# Altium schematic sheet semiCon.SchDoc
size A4; SheetNumber: 3; SheetTotal: 6
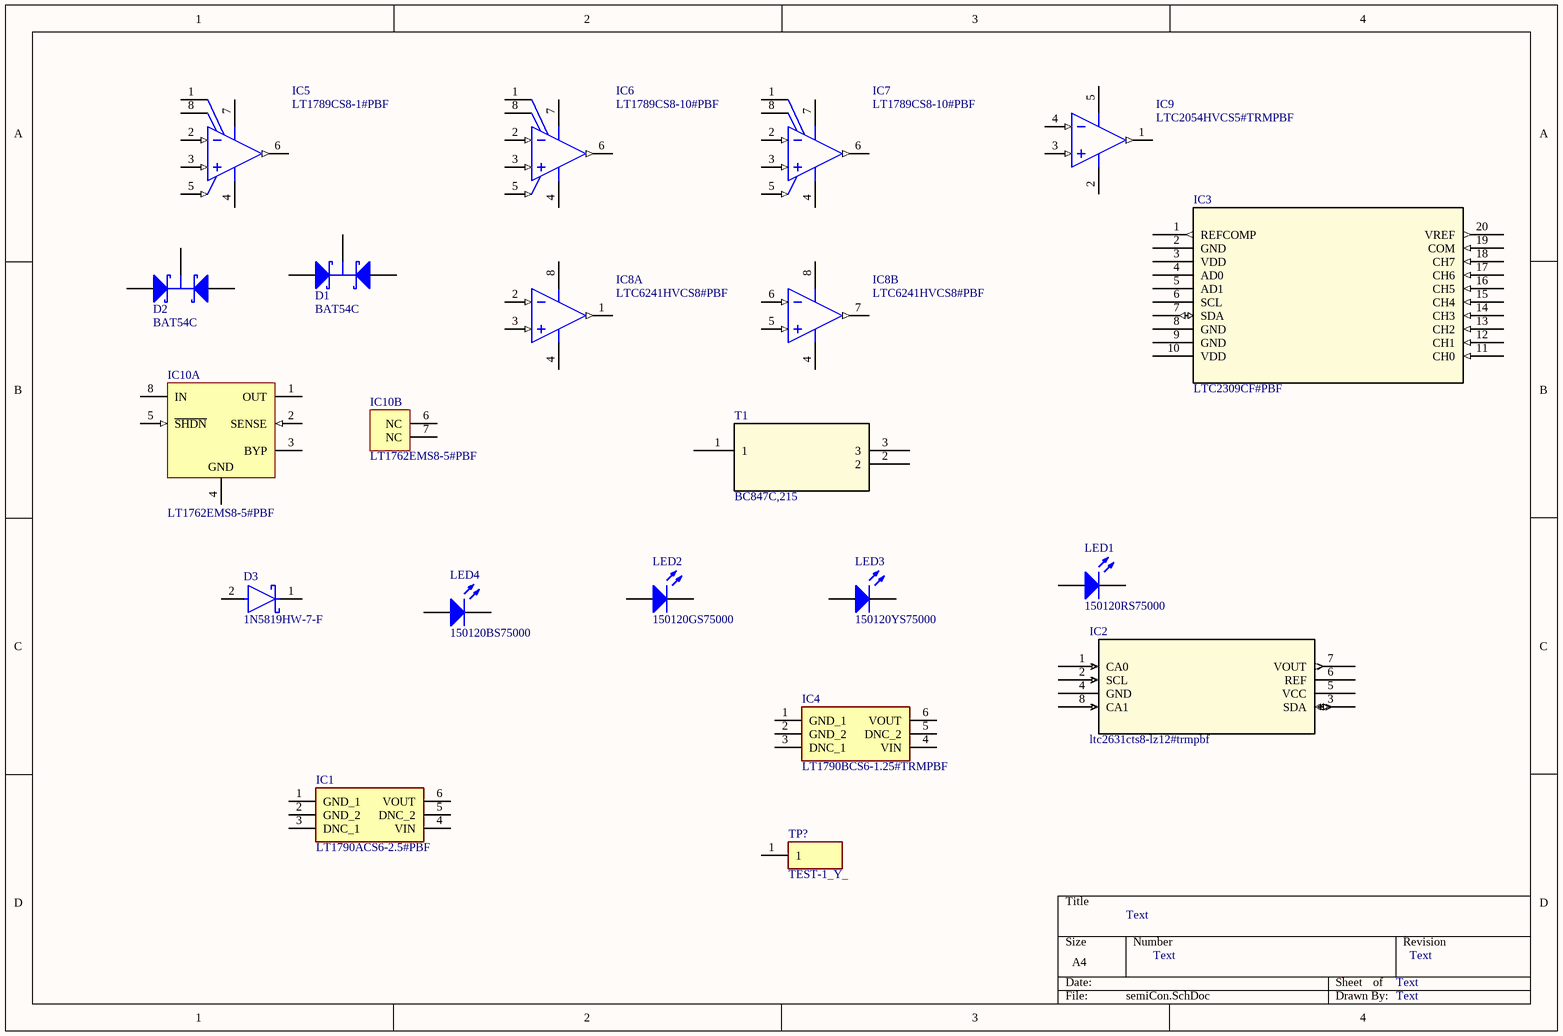
[diagram p0: semiCon.SchDoc]

## Parts
D1  BAT54C  [NXP-SOT23-3_V]
D2  BAT54C  [NXP-SOT23-3_V]
D3  1N5819HW-7-F  [FP-SOD123-IPC_A]
IC1  LT1790ACS6-2.5#PBF  [SOT95P280X100-6N]
IC2  ltc2631cts8-lz12#trmpbf  [SOT-8_TS_LIT]
IC3  LTC2309CF#PBF  [TSSOP-20_F_LIT]
IC4  LT1790BCS6-1.25#TRMPBF  [LT1790BCS6125TRMPBF]
IC5  LT1789CS8-1#PBF  [LT-S8-8_M]
IC6  LT1789CS8-10#PBF  [LT-S8-8_N]
IC7  LT1789CS8-10#PBF  [LT-S8-8_N]
IC8  LTC6241HVCS8#PBF  [LT-S8-8_M]  (parts A,B of 2)
IC9  LTC2054HVCS5#TRMPBF  [LT-S5-5-TSOT-23_L]
IC10  LT1762EMS8-5#PBF  [LT-MS8_N]  (parts A,B of 2)
LED1  150120RS75000  [1206_A]
LED2  150120GS75000  [1206_A]
LED3  150120YS75000  [1206_A]
LED4  150120BS75000  [1206_A]
T1  BC847C,215  [SOT23_BC847C_NEX]
TP?  TEST-1_Y_  [TEST1Y]

## Nets

Not connected (* = marked no-connect by the designer): D1 1(A) 2(A) 3(K); D2 1(A) 2(A) 3(K); D3 1(C) 2(A); IC1 1(GND_1) 2(GND_2) 3(DNC_1) 4(VIN) 5(DNC_2) 6(VOUT); IC2 1(CA0) 2(SCL) 3(SDA) 4(GND) 5(VCC) 6(REF) 7(VOUT) 8(CA1); IC3 1(REFCOMP) 2(GND) 3(VDD) 4(AD0) 5(AD1) 6(SCL) 7(SDA) 8(GND) 9(GND) 10(VDD) 11(CH0) 12(CH1) 13(CH2) 14(CH3) 15(CH4) 16(CH5) 17(CH6) 18(CH7) 19(COM) 20(VREF); IC4 1(GND_1) 2(GND_2) 3(DNC_1) 4(VIN) 5(DNC_2) 6(VOUT); IC5 1(RG) 2(-IN) 3(+IN) 4(-VS) 5(REF) 6(OUT) 7(+VS) 8(RG); IC6 1(RG) 2(-IN) 3(+IN) 4(-VS) 5(REF) 6(OUT) 7(+VS) 8(RG); IC7 1(RG) 2(-IN) 3(+IN) 4(-VS) 5(REF) 6(OUT) 7(+VS) 8(RG); IC8 1(OUT_A) 2(-IN_A) 3(+IN_A) 4(V-) 5(+IN_B) 6(-IN_B) 7(OUT_B) 8(V+); IC9 1(OUT) 2(V-) 3(+IN) 4(-IN) 5(V+); IC10 1(OUT) 2(SENSE) 3(BYP) 4(GND) 5(~{SHDN}) 6(NC) 7(NC) 8(IN); LED1 1(K) 2(A); LED2 1(K) 2(A); LED3 1(K) 2(A); LED4 1(K) 2(A); T1 1 2 3; TP? 1

## Notes on the sheet
- Text

## Library data of the parts
D1 D2 = CMP-0417-00003-1: Schottky Barrier Diode, 30 V, 2 uA, -55 to 150 degC, 3-Pin SOT23, RoHS, Tape and Reel; Manufacturer: NXP Semiconductors; IR (uA): 2; VF (mV): 800; Trr (ns): 5; Cd (pF): 10; VR (V): 30; Rth(j-a) (K/W): 500; RoHS: TRUE; Packing: Tape and Reel; ComponentLink2URL: http://www.nxp.com/documents/data_sheet/BAT54_SER.pdf; PartNumber: BAT54C; ComponentLink2Description: Datasheet; Temperature Range: -55 to 150 degC; PackageReference: SOT23-3; PackageDescription: 3-Pin Plastic Surface-mounted Package, Body 1.3 x 2.9 mm, Pitch 0.95 mm; Mounting Technology: Surface Mount; ComponentLink1URL: http://www.nxp.com/; DatasheetVersion: Rev. 5; ComponentLink1Description: Manufacturer URL
D3 = CMP-0303-00003-3: DIODE SCHOTTKY 40V 1A SOD123; Forward Voltage: 450mV; Capacitance: 110pF; Max Forward Surge Current (Ifsm): 25A; Peak Reverse Current: 50uA; Polarity: Standard; Element Configuration: Single; Max Power Dissipation: 450mW; Min Operating Temperature: -65°C; Package Quantity: 3000; Contact Plating: Tin; Weight: 0.000353oz; Max Repetitive Reverse Voltage (Vrrm): 40V; Max Reverse Voltage (DC): 40V; Height: 1.25mm; Average Rectified Current: 1A; Width: 1.7mm; Case/Package: SOD-123-2; Lead Free: Lead Free; Max Operating Temperature: 125°C; Current Rating: 1A; Termination: SMD/SMT; Forward Current: 1A; Radiation Hardening: No; Number of Pins: 2; Length: 2.85mm; Voltage Rating (DC): 40V; REACH SVHC: No SVHC; Peak Non-Repetitive Surge Current: 25A; Packaging: Tape and Reel; Output Current: 1A
IC1 = LT1790ACS6-2.5#PBF: Integrated Circuit; Manufacturer_Name: Linear Technology; Datasheet Link: https://componentsearchengine.com/Datasheets/2/LT1790ACS6-2.5#PBF.pdf; Height: 1mm; Manufacturer_Part_Number: LT1790ACS6-2.5#PBF; Mouser Part Number: 584-1790ACS6-2.5PBF; Mouser Price/Stock: https://www.mouser.com/Search/Refine.aspx?Keyword=584-1790ACS6-2.5PBF
IC2 = ltc2631cts8-lz12#trmpbf: No Description Available; Vendor: Linear Technology; Built_By: EMA_UL_Team; SourceLibrary: LinearTech_2016_03_08; Manufacturer_Part_Number: ltc2631cts8-lz12#trmpbf; Copyright: Copyright (C) 2018 Accelerated Designs. All rights reserved; RefDes: RefDes; Type: DEV
IC3 = LTC2309CF#PBF: No Description Available; Vendor: Linear Technology; Built_By: EMA_UL_Team; SourceLibrary: LinearTech_2016-05-13_3; Manufacturer_Part_Number: LTC2309CF#PBF; Copyright: Copyright (C) 2018 Accelerated Designs. All rights reserved; RefDes: RefDes; Type: DEV
IC4 = LT1790BCS6-1.25#TRMPBF: Integrated Circuit; Manufacturer_Name: Analog Devices; Datasheet Link: https://www.arrow.com/en/products/lt1790bcs6-1.25trmpbf/analog-devices; Height: 1mm; Manufacturer_Part_Number: LT1790BCS6-1.25#TRMPBF; Mouser Part Number: 584-1790BCS61.25TMPF; Mouser Price/Stock: https://www.mouser.co.uk/ProductDetail/Analog-Devices/LT1790BCS6-125TRMPBF/?qs=ytflclh7QUXpPD13KZ8jjg%3D%3D; Arrow Part Number: LT1790BCS6-1.25#TRMPBF; Arrow Price/Stock: https://www.arrow.com/en/products/lt1790bcs6-1.25trmpbf/analog-devices
IC5 = CMP-0359-03660-2: Single Channel, Micropower, Single Supply Rail-to-Rail Output Instrumentation Amplifiers, 0.06 MHz Typical GBW, 0.026 V/us Typical SR, 2.2 to 36 V, 8-Pin SOIC (S8-8), Commercial, Pb-Free; Manufacturer: Linear Technology; Linear Technology Part Number: LT1789-1; Vos (mV) Typical: 0.15; Vs Max (V): 36; Vos (mV) Guaranteed: 0.75; Is (mA) Typical: 0.067; SR (V/us) Typical: 0.026; Vs Min (V): 2.2; Channels (#): 1; GBW (MHz) Typical: 0.06; PackageVersion: Rev G; ComponentLink1URL: http://www.linear.com/; ComponentLink2URL: http://cds.linear.com/docs/en/datasheet/1789fc.pdf; RoHS: Pb-Free; Mounting Technology: Surface Mount; RevisionNote: URLs updated; ComponentLink3URL: http://cds.linear.com/docs/en/packaging/05081610_G_SO8.pdf; PartNumber: LT1789CS8-1#PBF; DatasheetVersion: Rev. C; ComponentLink3Description: Package Specification; ComponentLink2Description: Datasheet; ComponentLink1Description: Manufacturer URL; Type: IA; PackageDescription: 8-Pin Plastic Small Outline, Body 4.9 x 3.9 mm, Pitch 1.27 mm; PackageReference: LT-S8-8
IC6 IC7 = CMP-0359-03644-3: Single Channel, Micropower, Single Supply Rail-to-Rail Output Instrumentation Amplifiers, 0.06 MHz Typical GBW, 0.026 V/us Typical SR, 2.2 to 36 V, 8-Pin SOIC (S8-8), Commercial, Pb-Free; Manufacturer: Linear Technology; Linear Technology Part Number: LT1789-10; Vos (mV) Typical: 0.65; SR (V/us) Typical: 0.026; GBW (MHz) Typical: 0.06; Channels (#): 1; Is (mA) Typical: 0.067; Vs Max (V): 36; Vos (mV) Guaranteed: 3; Vs Min (V): 2.2; PartNumber: LT1789CS8-10#PBF; PackageDescription: 8-Pin Plastic Small Outline, Body 4.9 x 3.9 mm, Pitch 1.27 mm; Mounting Technology: Surface Mount; ComponentLink1URL: http://www.linear.com/; DatasheetVersion: Rev. C; ComponentLink2Description: Datasheet; RoHS: Pb-Free; ComponentLink3Description: Package Specification; Type: IA; PackageReference: LT-S8-8; RevisionNote: URLs updated; ComponentLink1Description: Manufacturer URL; ComponentLink2URL: http://cds.linear.com/docs/en/datasheet/1789fc.pdf; ComponentLink3URL: http://cds.linear.com/docs/en/packaging/05081610_G_SO8.pdf; PackageVersion: Rev G
IC8 = CMP-0359-02698-2: Dual Channel, Low Noise, CMOS Operational Amplifier, RRO, 18 MHz Typical GBW, 10 V/us Typical SR, 2.8 to 12 V, 8-Pin SOIC (S8-8), Commercial, Pb-Free; Manufacturer: Linear Technology; SR (V/us) Typical: 10; Vs Min (V): 2.8; Is (mA) Typical: 1.8; Channels (#): 2; GBW (MHz) Typical: 18; Vos (mV) Typical: 0.04; Vs Max (V): 12; Type: VFB; RoHS: Pb-Free; ComponentLink3Description: Package Specification; DatasheetVersion: Rev. E; ComponentLink1Description: Manufacturer URL; RevisionNote: URLs updated; ComponentLink2Description: Datasheet; ComponentLink3URL: http://cds.linear.com/docs/en/packaging/05081610_G_SO8.pdf; Mounting Technology: Surface Mount; PackageDescription: 8-Pin Plastic Small Outline, Body 4.9 x 3.9 mm, Pitch 1.27 mm; PackageVersion: Rev G; Linear Technology Part Number: LTC6241HV; ComponentLink2URL: http://cds.linear.com/docs/en/datasheet/624012fe.pdf; PartNumber: LTC6241HVCS8#PBF; PackageReference: LT-S8-8; ComponentLink1URL: http://www.linear.com/
IC9 = CMP-0359-02161-2: Single Channel, Micropower Zero-Drift Operational Amplifier, 0.5 MHz Typical GBW, 0.5 V/us Typical SR, 2.7 to 11 V, 5-Pin SOT23 (S5-5), Commercial, Pb-Free, Mini Reel; Manufacturer: Linear Technology; Vs Min (V): 2.7; Vos (mV) Typical: 0.0005; SR (V/us) Typical: 0.5; Channels (#): 1; Vs Max (V): 11; Is (mA) Typical: 0.15; ComponentLink1URL: http://www.linear.com/; ComponentLink1Description: Manufacturer URL; Packing: Mini Reel; PackageReference: LT-S5-5-TSOT-23; ComponentLink3URL: http://cds.linear.com/docs/en/packaging/SOT_5_05-08-1635.pdf; Type: ZD; PackageDescription: 5-Lead Plastic TSOT-23, Body 1.63 x 2.90 mm, Pitch 0.95 mm; RoHS: Pb-Free; RevisionNote: URLs updated; ComponentLink2URL: http://cds.linear.com/docs/en/datasheet/20545fc.pdf; Code_JEDEC: MO-193; PartNumber: LTC2054HVCS5#TRMPBF; GBW (MHz) Typical: 0.5; DatasheetVersion: Rev. C; Mounting Technology: Surface Mount; Linear Technology Part Number: LTC2054HV; ComponentLink2Description: Datasheet; ComponentLink3Description: Package Specification
IC10 = CMP-0476-00707-1: 150 mA, Low Noise, LDO Micropower Regulator, 1.8 to 20 V Vin, 5 V Vout, 8-pin SOP (MS8-8), -40 to 125 degC, Pb-Free; Manufacturer: Linear Technology; Iout(mA): 150; Output Voltage: 5 V; Isupply(mA): 0.025; Noise(uV): 20; Number of Outputs: 1; PSRR(dB): 65; Vin Min(V): 1.8; Dropout Voltage(V): 0.27; Discrete Pass Element: no; Mounting Technology: Surface Mount; ComponentLink3URL: http://cds.linear.com/docs/en/packaging/05081660_G_MS8.pdf; DatasheetVersion: Rev. A; PackageDescription: 8-Pin Plastic MSOP, Body 3 x 3 mm, Pitch 0.65 mm; RoHS: TRUE; PartNumber: LT1762EMS8-5#PBF; ComponentLink2URL: http://cds.linear.com/docs/en/datasheet/1762fa.pdf; PackageReference: MS8; PackageVersion: Rev. G, 05/2013; ComponentLink2Description: Datasheet; ComponentLink3Description: Package Specification; ComponentLink1Description: Manufacturer URL; Shutdown Current(uA): 1; Vin Max(V): 20; ComponentLink1URL: http://www.linear.com/
LED1 = CMP-1426-00013-1: SMD mono-color Chip LED, WL-SMCW, Red; Manufacturer: Wuerth Elektronik; Color: Red; ComponentLink2URL: http://katalog.we-online.com/led/datasheet/150120RS75000.pdf; ComponentLink2Description: Datasheet; ComponentLink1Description: Manufacturer URL; ComponentLink1URL: http://www.we-online.com; PartNumber: 150120RS75000; PackageReference: 1206_A
LED2 = CMP-1426-00014-1: SMD mono-color Chip LED, WL-SMCW, Green; Manufacturer: Wuerth Elektronik; PackageReference: 1206_A; PartNumber: 150120GS75000; ComponentLink1Description: Manufacturer URL; ComponentLink2URL: http://katalog.we-online.com/led/datasheet/150120GS75000.pdf; ComponentLink2Description: Datasheet; Color: Green; ComponentLink1URL: http://www.we-online.com
LED3 = CMP-1426-00019-1: SMD mono-color Chip LED, WL-SMCW, Yellow; Manufacturer: Wuerth Elektronik; ComponentLink2URL: http://katalog.we-online.com/led/datasheet/150120YS75000.pdf; PartNumber: 150120YS75000; ComponentLink1URL: http://www.we-online.com; Color: Yellow; ComponentLink1Description: Manufacturer URL; PackageReference: 1206_A; ComponentLink2Description: Datasheet
LED4 = CMP-1426-00015-1: SMD mono-color Chip LED, WL-SMCW, Blue; Manufacturer: Wuerth Elektronik; ComponentLink2Description: Datasheet; ComponentLink1URL: http://www.we-online.com; PartNumber: 150120BS75000; ComponentLink1Description: Manufacturer URL; ComponentLink2URL: http://katalog.we-online.com/led/datasheet/150120BS75000.pdf; PackageReference: 1206_A; Color: Blue
T1 = BC847C,215: No Description Available; Built_By: EMA_Justin; Vendor: Nexperia; SourceLibrary: Nexperia_2018-12-15; Type: DEV; Copyright: Copyright (C) 2016 Accelerated Designs. All rights reserved; Manufacturer_Part_Number: BC847C,215; RefDes: RefDes
TP? = TEST-1_Y_: Test Point; Manufacturer_Name: MULTICOMP; Manufacturer_Part_Number: TEST-1(Y); Datasheet Link: http://www.farnell.com/datasheets/1662407.pdf; Height: 5.5mm